# EAGLE schematic plugwatch (EAGLE 9.5.0)
AUTHOR: Joshua Adkins; REV: G; TITLE: PowerWatch

## Sheet 1 of 6: AC input, voltage sensing, AC/DC
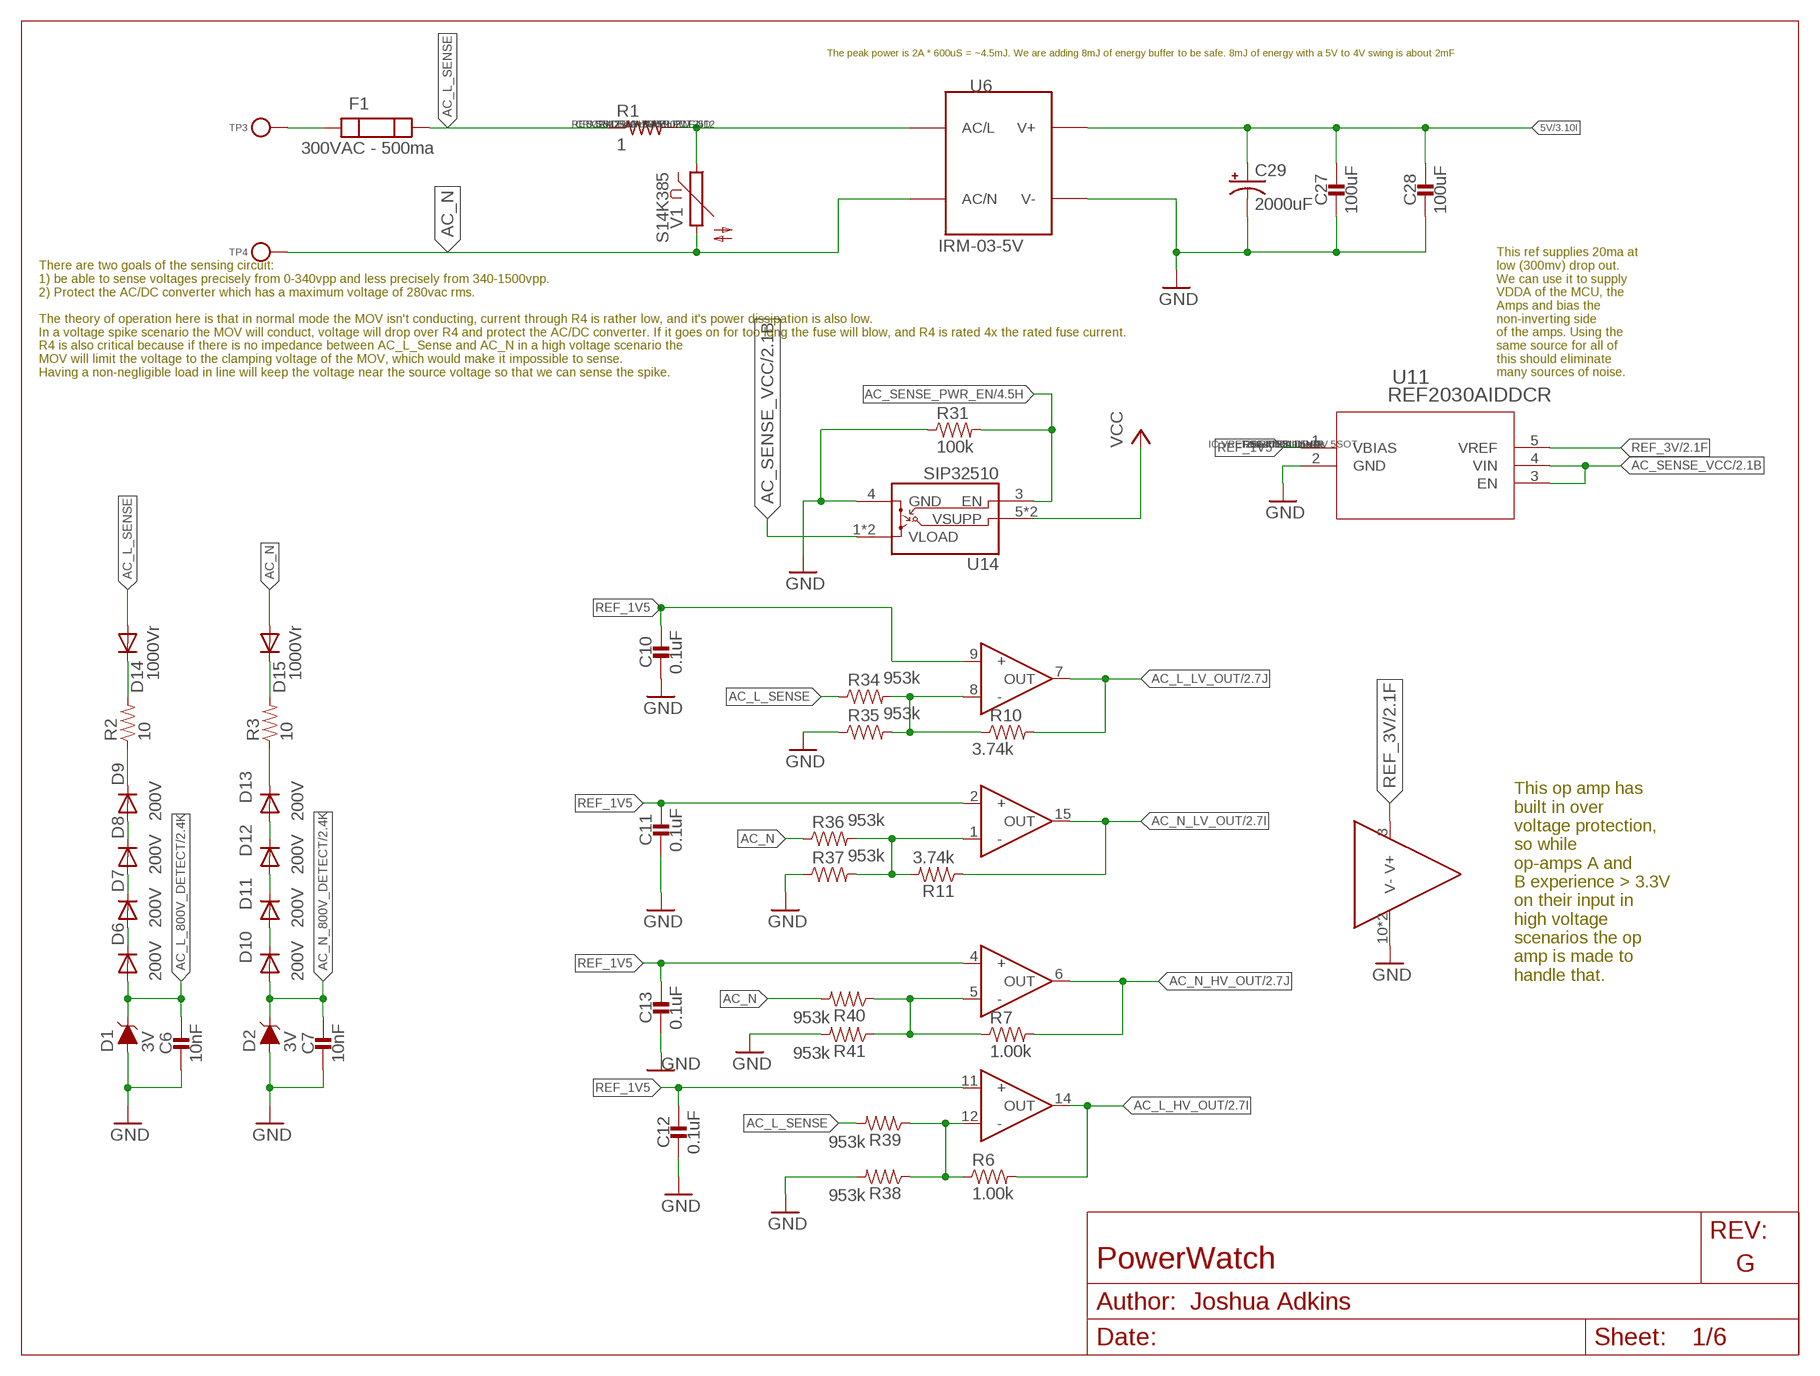
[diagram p0: schematic, sheet 1]

### Parts
C6  10nF  CAPACITOR0402_CAP  [0402_CAP]
C7  10nF  CAPACITOR0402_CAP  [0402_CAP]
C10  0.1uF  CAPACITOR0402_CAP  [0402_CAP]
C11  0.1uF  CAPACITOR0402_CAP  [0402_CAP]
C12  0.1uF  CAPACITOR0402_CAP  [0402_CAP]
C13  0.1uF  CAPACITOR0402_CAP  [0402_CAP]
C27  100uF  CAPACITOR1210_CAP  [1210_CAP]
C28  100uF  CAPACITOR1210_CAP  [1210_CAP]
C29  2000uF  CPOL-USE5-10.5  [E5-10,5]
D1  3V  DIODE-ZENER-MM3Z3V3T1G  [SOD-323]
D2  3V  DIODE-ZENER-MM3Z3V3T1G  [SOD-323]
D6  200V  DIODE-DO214AA  [DO214AA]
D7  200V  DIODE-DO214AA  [DO214AA]
D8  200V  DIODE-DO214AA  [DO214AA]
D9  200V  DIODE-DO214AA  [DO214AA]
D10  200V  DIODE-DO214AA  [DO214AA]
D11  200V  DIODE-DO214AA  [DO214AA]
D12  200V  DIODE-DO214AA  [DO214AA]
D13  200V  DIODE-DO214AA  [DO214AA]
D14  1000Vr  DIODE-DO214AC  [DO214AC]
D15  1000Vr  DIODE-DO214AC  [DO214AC]
F1  300VAC - 500ma  MICRO_FUSE500MA_350VAC  [MIRCRO_FUSE_5MM]
R1  1  R-US_R2512  [R2512]
R2  10  RESISTOR0402_RES  [0402_RES]
R3  10  RESISTOR0402_RES  [0402_RES]
R6  1.00k  RESISTOR0402_RES  [0402_RES]
R7  1.00k  RESISTOR0402_RES  [0402_RES]
R10  3.74k  RESISTOR0402_RES  [0402_RES]
R11  3.74k  RESISTOR0402_RES  [0402_RES]
R31  100k  RESISTOR0402_RES  [0402_RES]
R34  953k  RESISTOR0805_RES  [0805_RES]
R35  953k  RESISTOR0805_RES  [0805_RES]
R36  953k  RESISTOR0805_RES  [0805_RES]
R37  953k  RESISTOR0805_RES  [0805_RES]
R38  953k  RESISTOR0805_RES  [0805_RES]
R39  953k  RESISTOR0805_RES  [0805_RES]
R40  953k  RESISTOR0805_RES  [0805_RES]
R41  953k  RESISTOR0805_RES  [0805_RES]
TP3  TEST_POINT_0.078IN  [TESTPOINT_0.078IN]
TP4  TEST_POINT_0.078IN  [TESTPOINT_0.078IN]
U2  ADA4096-4ACPZ-R7  [CP_16_27]
U6  IRM-03-5V  [IRM-03]
U11  REF2030AIDDCR  REF2033AIDDCR  [DDC5]
U14  SIP32510  [TSOT23-6]
V1  S14K385  [S14K385]

### Nets
5V: C27.1 C28.1 C29.+ U6.V+ ; also sheet 3,4
AC_L_800V_DETECT: C6.1 D1.C D6.A ; also sheet 2,4
AC_L_HV_OUT: R6.2 U2.14(D:OUT) ; also sheet 2,4
AC_L_LV_OUT: R10.2 U2.7(C:OUT) ; also sheet 2,4
AC_L_SENSE: D14.A F1.P$2 R1.1 R34.1 R39.2
AC_N: D15.A R36.1 R40.2 TP4.1(TESTPOINT) U6.AC/N V1.2
AC_N_800V_DETECT: C7.1 D2.C D10.A ; also sheet 2,4
AC_N_HV_OUT: R7.2 U2.6(B:OUT) ; also sheet 2,4
AC_N_LV_OUT: R11.1 U2.15(A:OUT) ; also sheet 2,4
AC_SENSE_PWR_EN: R31.2 U14.3(EN) ; also sheet 4
AC_SENSE_VCC: U11.3(EN) U11.4(VIN) U14.1(VLOAD) U14.2(VLOAD) ; also sheet 2
GND: C6.2 C7.2 C10.2 C11.2 C12.2 C13.2 C27.2 C28.2 C29.- D1.A D2.A R31.1 R35.1 R37.1 R38.2 R41.2 U2.10(SUPPLY:V-) U2.17(SUPPLY:V-) U6.V- U11.2(GND) U14.4(GND) ; also sheet 2,3,4,5,6
N$2: R1.2 U6.AC/L V1.1
N$3: R11.2 R36.2 R37.2 U2.1(A:-)
N$4: R10.1 R34.2 R35.2 U2.8(C:-)
N$6: R6.1 R38.1 R39.1 U2.12(D:-)
N$8: R7.1 R40.1 R41.1 U2.5(B:-)
N$12: F1.P$1 TP3.1(TESTPOINT)
N$14: D8.C D9.A
N$15: D7.C D8.A
N$16: D6.C D7.A
N$30: D9.C R2.1
N$32: D14.C R2.2
N$35: D12.C D13.A
N$37: D11.C D12.A
N$38: D10.C D11.A
N$46: D13.C R3.1
N$47: D15.C R3.2
REF_1V5: C10.1 C11.1 C12.1 C13.1 U2.2(A:+) U2.4(B:+) U2.9(C:+) U2.11(D:+) U11.1(VBIAS)
REF_3V: U2.3(SUPPLY:V+) U11.5(VREF) ; also sheet 2
VCC: U14.5(VSUPP) U14.6(VSUPP) ; also sheet 2,3,4,5,6

### Notes on the sheet
- The peak power is 2A * 600uS = ~4.5mJ. We are adding 8mJ of energy buffer to be safe. 8mJ of energy with a 5V to 4V swing is about 2mF
- There are two goals of the sensing circuit: 
  1) be able to sense voltages precisely from 0-340vpp and less precisely from 340-1500vpp. 
  2) Protect the AC/DC converter which has a maximum voltage of 280vac rms. 
  
  The theory of operation here is that in normal mode the MOV isn't conducting, current through R4 is rather low, and it's power dissipation is also low. 
  In a voltage spike scenario the MOV will conduct, voltage will drop over R4 and protect the AC/DC converter. If it goes on for too long the fuse will blow, and R4 is rated 4x the rated fuse current. 
  R4 is also critical because if there is no impedance between AC_L_Sense and AC_N in a high voltage scenario the 
  MOV will limit the voltage to the clamping voltage of the MOV, which would make it impossible to sense. 
  Having a non-negligible load in line will keep the voltage near the source voltage so that we can sense the spike.
- This ref supplies 20ma at 
  low (300mv) drop out. 
  We can use it to supply 
  VDDA of the MCU, the 
  Amps and bias the 
  non-inverting side 
  of the amps. Using the 
  same source for all of 
  this should eliminate 
  many sources of noise.
- This op amp has 
  built in over 
  voltage protection, 
  so while 
  op-amps A and 
  B experience > 3.3V 
  on their input in 
  high voltage 
  scenarios the op 
  amp is made to 
  handle that.

## Sheet 2 of 6: Voltage Coprocessor
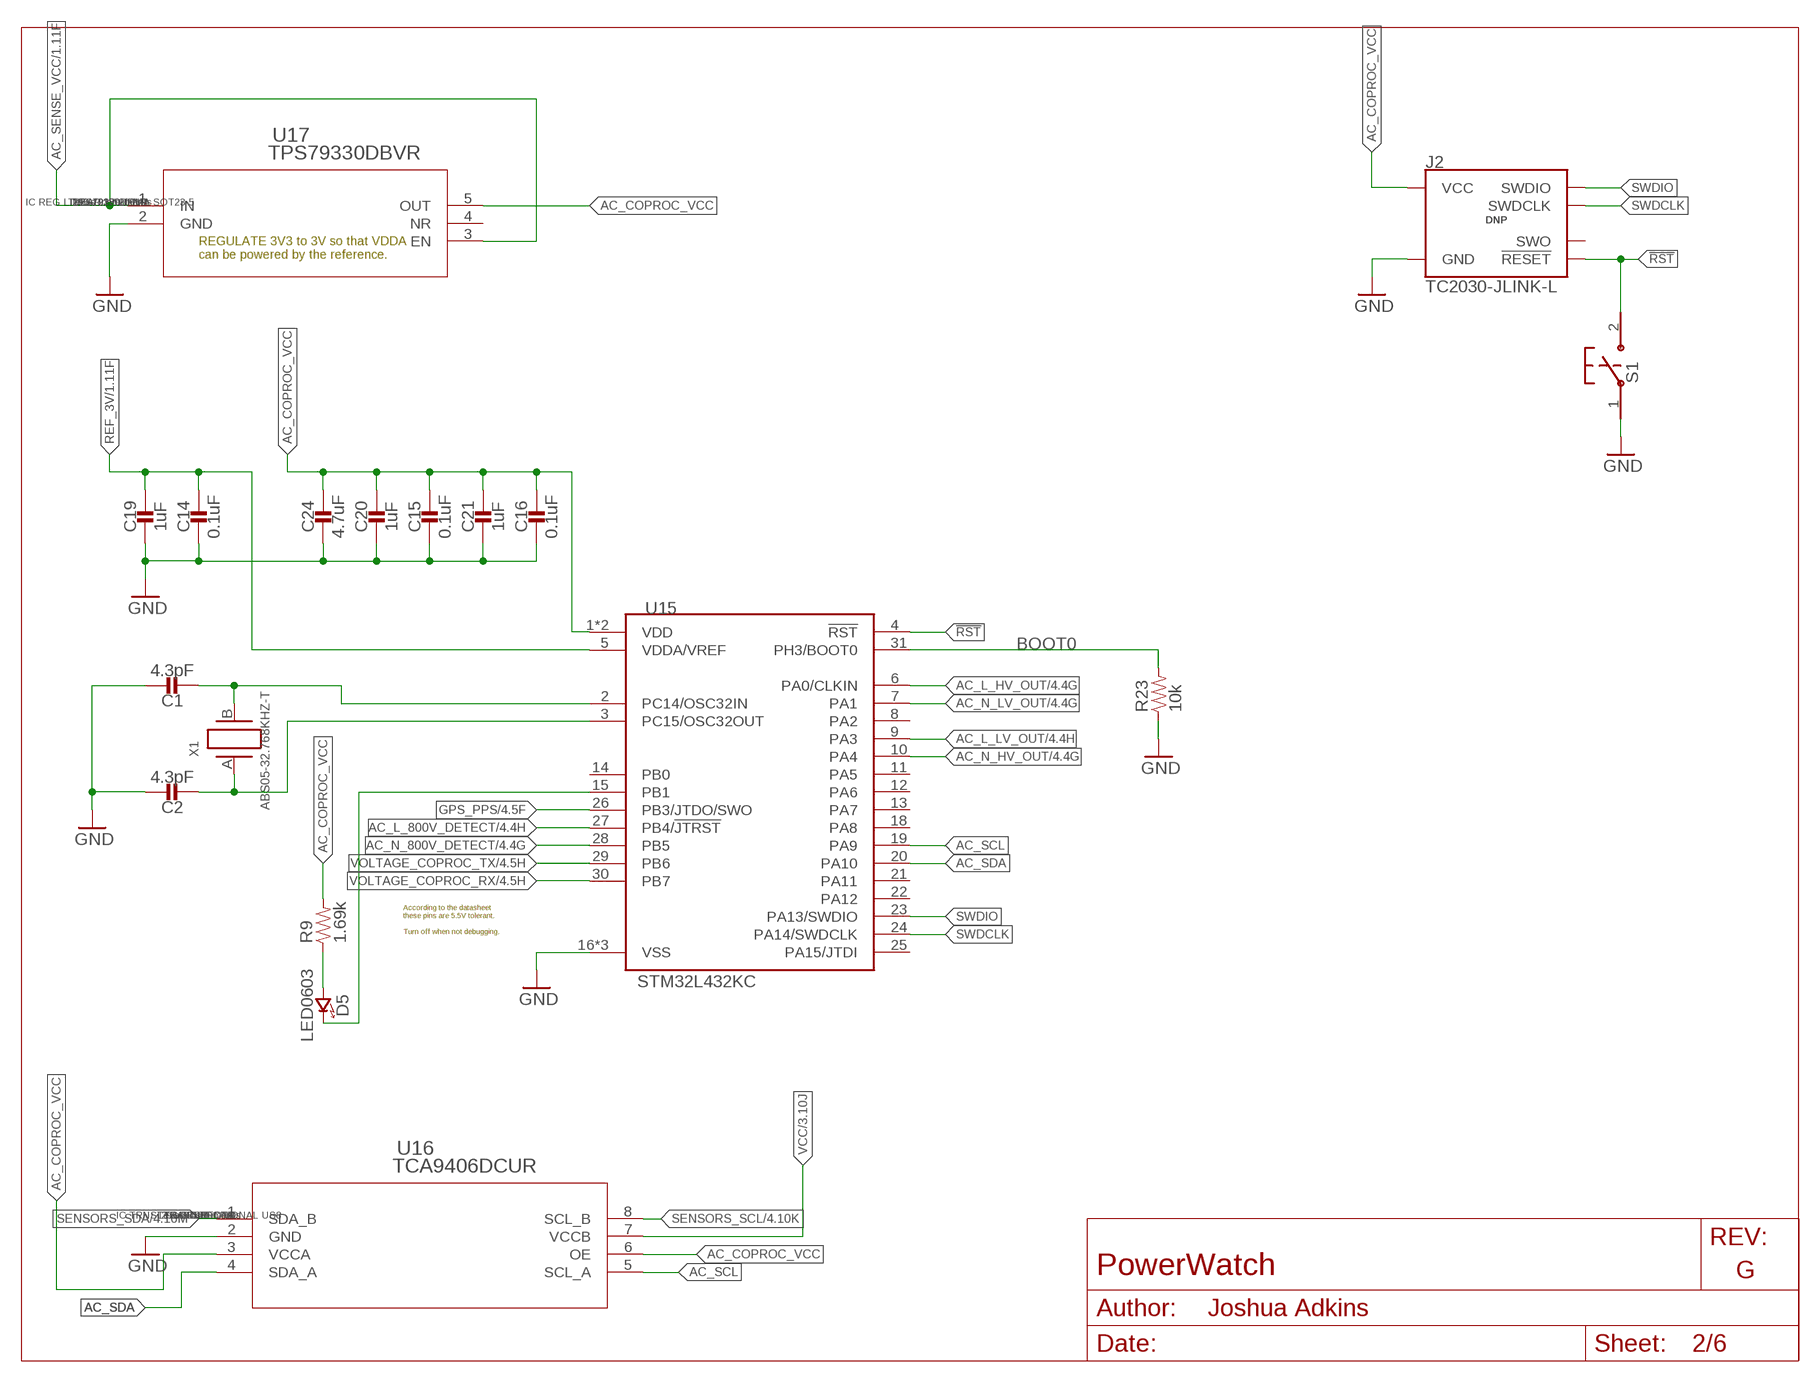
[diagram p1: schematic, sheet 2]

### Parts
C1  4.3pF  CAPACITOR0402_CAP  [0402_CAP]
C2  4.3pF  CAPACITOR0402_CAP  [0402_CAP]
C14  0.1uF  CAPACITOR0402_CAP  [0402_CAP]
C15  0.1uF  CAPACITOR0402_CAP  [0402_CAP]
C16  0.1uF  CAPACITOR0402_CAP  [0402_CAP]
C19  1uF  CAPACITOR0402_CAP  [0402_CAP]
C20  1uF  CAPACITOR0402_CAP  [0402_CAP]
C21  1uF  CAPACITOR0402_CAP  [0402_CAP]
C24  4.7uF  CAPACITOR0402_CAP  [0402_CAP]
D5  LED0603  [LED-0603]
J2  TC2030-JLINK-L  [TC2030-IDC]
R9  1.69k  RESISTOR0402_RES  [0402_RES]
R23  10k  RESISTOR0402_RES  [0402_RES]
S1  B3U-1000P  [B3U-1000P]
U15  STM32L432KC  [UQFN-32]
U16  TCA9406DCUR  [DCU8]
U17  TPS79330DBVR  [DBV5]
X1  ABS05-32.768KHZ-T  [ABS05]

### Nets
!RST: J2.3(!RESET) S1.2 U15.4(!RST)
AC_COPROC_VCC: C15.1 C16.1 C20.1 C21.1 C24.1 J2.1(VCC) R9.2 U15.1(VDD) U15.17(VDD) U16.3(VCCA) U16.6(OE) U17.5(OUT)
AC_L_800V_DETECT: U15.27(PB4/!JTRST) ; also sheet 1,4
AC_L_HV_OUT: U15.6(PA0/CLKIN) ; also sheet 1,4
AC_L_LV_OUT: U15.9(PA3) ; also sheet 1,4
AC_N_800V_DETECT: U15.28(PB5) ; also sheet 1,4
AC_N_HV_OUT: U15.10(PA4) ; also sheet 1,4
AC_N_LV_OUT: U15.7(PA1) ; also sheet 1,4
AC_SCL: U15.19(PA9) U16.5(SCL_A)
AC_SDA: U15.20(PA10) U16.4(SDA_A)
AC_SENSE_VCC: U17.1(IN) U17.3(EN) ; also sheet 1
BOOT0: R23.2 U15.31(PH3/BOOT0)
GND: C1.1 C2.1 C14.2 C15.2 C16.2 C19.2 C20.2 C21.2 C24.2 J2.5(GND) R23.1 S1.1 U15.16(VSS) U15.32(VSS) U15.THERMAL(VSS) U16.2(GND) U17.2(GND) ; also sheet 1,3,4,5,6
GPS_PPS: U15.26(PB3/JTDO/SWO) ; also sheet 4,5
N$1: D5.A(ANODE) R9.1
N$7: D5.C(CATHODE) U15.15(PB1)
N$9: C2.2 U15.3(PC15/OSC32OUT) X1.A
N$11: C1.2 U15.2(PC14/OSC32IN) X1.B
REF_3V: C14.1 C19.1 U15.5(VDDA/VREF) ; also sheet 1
SENSORS_SCL: U16.8(SCL_B) ; also sheet 4,6
SENSORS_SDA: U16.1(SDA_B) ; also sheet 4,6
SWDCLK: J2.4(SWDCLK) U15.24(PA14/SWDCLK)
SWDIO: J2.2(SWDIO) U15.23(PA13/SWDIO)
VCC: U16.7(VCCB) ; also sheet 1,3,4,5,6
VOLTAGE_COPROC_RX: U15.30(PB7) ; also sheet 4
VOLTAGE_COPROC_TX: U15.29(PB6) ; also sheet 4
Unconnected: J2.6(SWO) U15.8(PA2) U15.11(PA5) U15.12(PA6) U15.13(PA7) U15.14(PB0) U15.18(PA8) U15.21(PA11) U15.22(PA12) U15.25(PA15/JTDI) U17.4(NR)

### Notes on the sheet
- REGULATE 3V3 to 3V so that VDDA
  can be powered by the reference.
- According to the datasheet
  these pins are 5.5V tolerant.
  
  Turn off when not debugging.

## Sheet 3 of 6: Supervisor, Watchdog, RTC
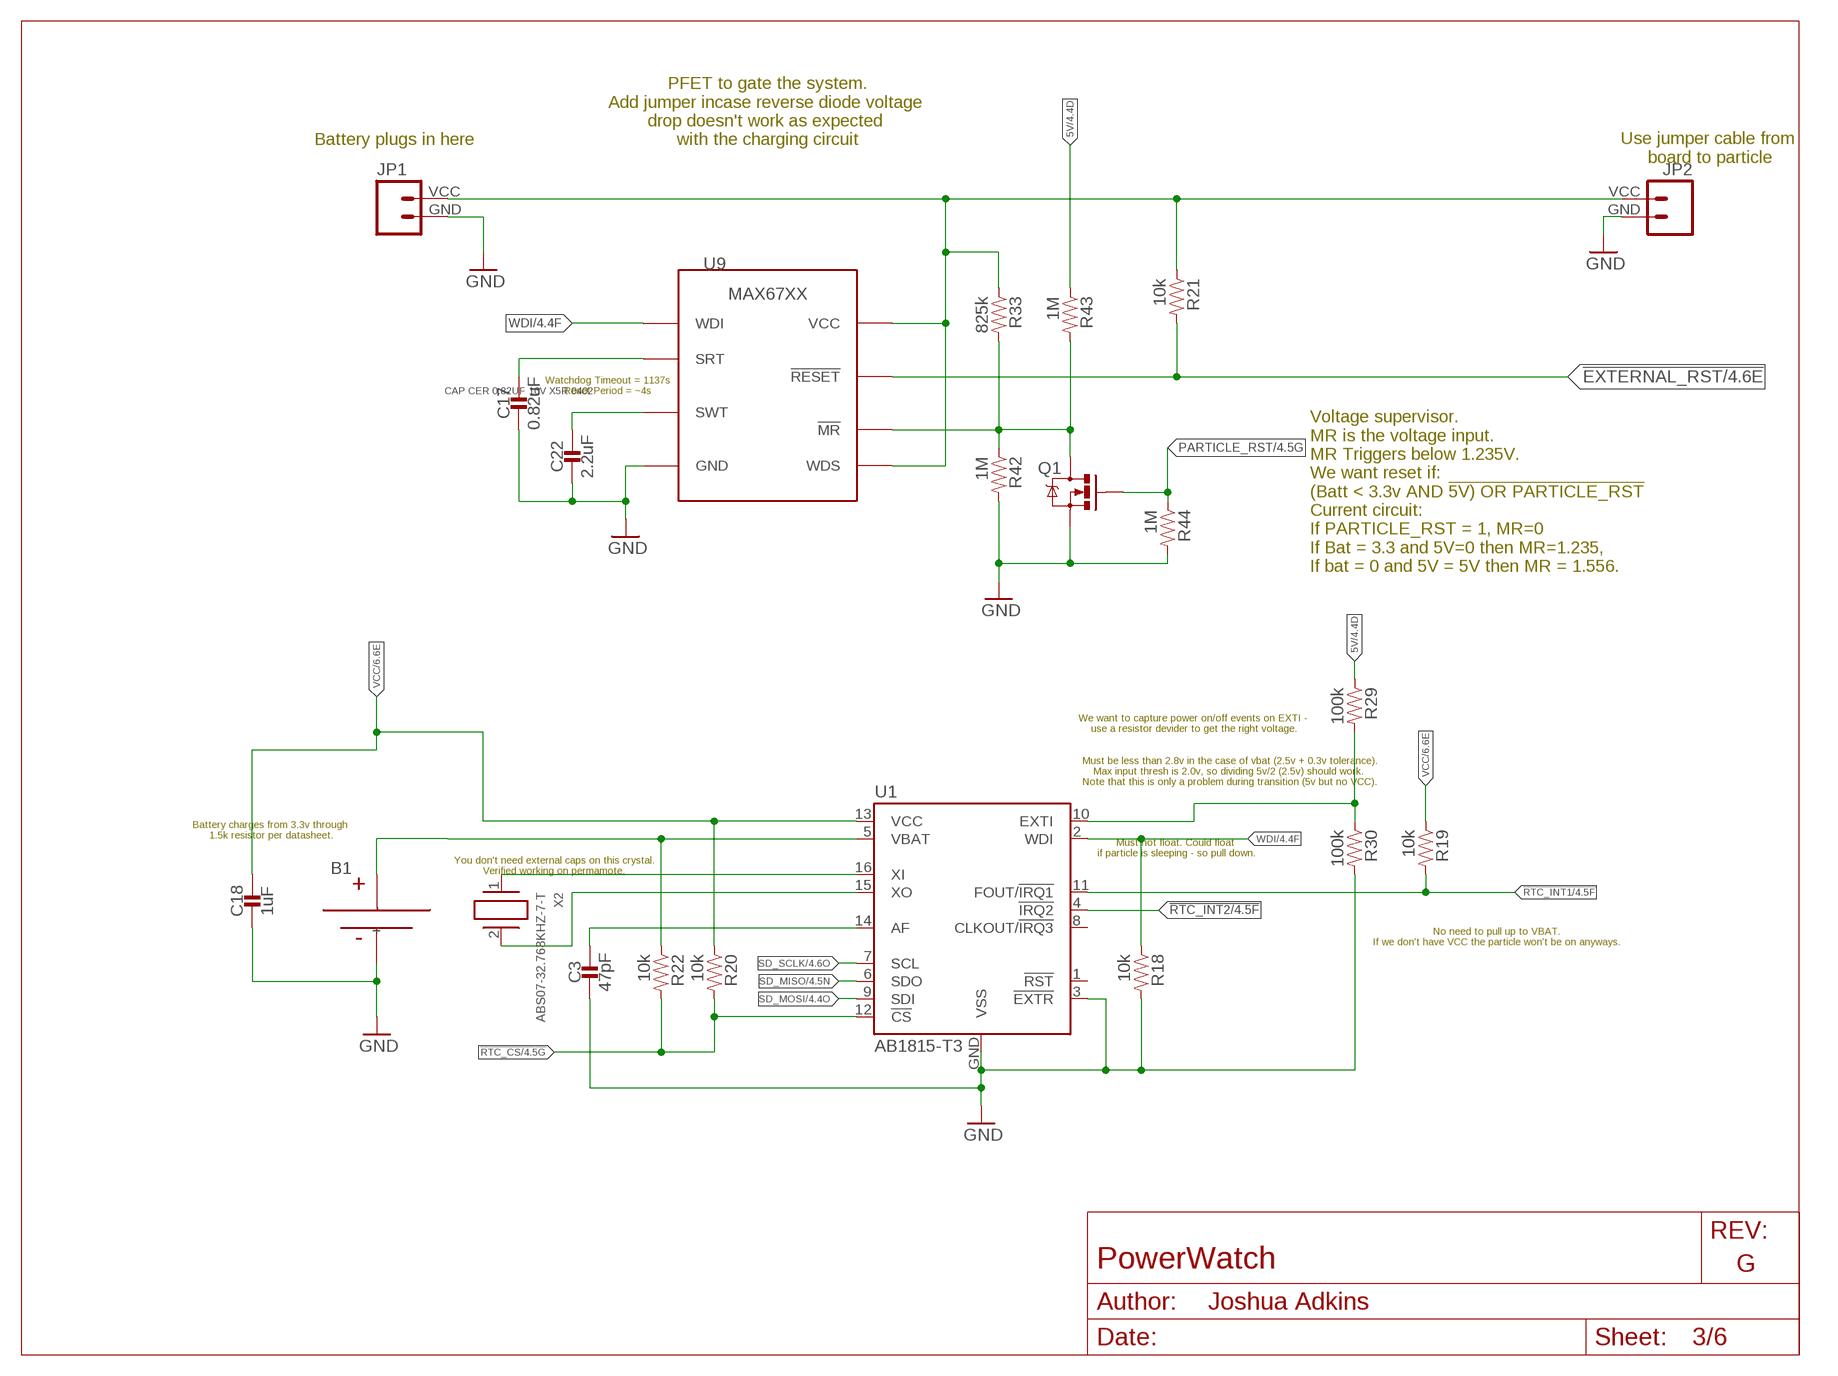
[diagram p2: schematic, sheet 3]

### Parts
B1  MS518SE  [MS518SE-FL35E]
C3  47pF  CAPACITOR0402_CAP  [0402_CAP]
C17  0.82uF  CAPACITOR0402_CAP  [0402_CAP]
C18  1uF  CAPACITOR0402_CAP  [0402_CAP]
C22  2.2uF  CAPACITOR0402_CAP  [0402_CAP]
JP1  M024UCON-15767  [JST-2-SMD-VERT]
JP2  M024UCON-15767  [JST-2-SMD-VERT]
Q1  MOSFET-NCHANNELSMD  [SOT23-3]
R18  10k  RESISTOR0402_RES  [0402_RES]
R19  10k  RESISTOR0402_RES  [0402_RES]
R20  10k  RESISTOR0402_RES  [0402_RES]
R21  10k  RESISTOR0402_RES  [0402_RES]
R22  10k  RESISTOR0402_RES  [0402_RES]
R29  100k  RESISTOR0402_RES  [0402_RES]
R30  100k  RESISTOR0402_RES  [0402_RES]
R33  825k  RESISTOR0402_RES  [0402_RES]
R42  1M  RESISTOR0402_RES  [0402_RES]
R43  1M  RESISTOR0402_RES  [0402_RES]
R44  1M  RESISTOR0402_RES  [0402_RES]
U1  AB1815-T3  [QFN-16-3MM]
U9  MAX67XXMAX6749MAX67XX  [SOT-23-8]
X2  ABS07-32.768KHZ-7-T  [2-SMD]

### Nets
5V: R29.1 R43.1 ; also sheet 1,4
!EXTERNAL_RST: R21.2 U9.7(!RESET) ; also sheet 4
!RTC_CS: R20.2 R22.2 U1.12(!CS) ; also sheet 4
!RTC_INT1: R19.2 U1.11(FOUT/!IRQ1) ; also sheet 4
!RTC_INT2: U1.4(!IRQ2) ; also sheet 4
GND: B1.- C3.2 C17.2 C18.2 C22.2 JP1.GND JP2.GND Q1.2(S) R18.2 R30.2 R42.2 R44.2 U1.3(!EXTR) U1.GND(VSS) U9.4(GND) ; also sheet 1,2,4,5,6
N$5: B1.+ R22.1 U1.5(VBAT)
N$13: C3.1 U1.14(AF)
N$20: U1.15(XO) X2.2
N$21: U1.16(XI) X2.1
N$23: JP1.VCC JP2.VCC R21.1 R33.1 U9.5(WDS) U9.8(VCC)
N$25: R29.2 R30.1 U1.10(EXTI)
N$31: Q1.3(D) R33.2 R42.1 R43.2 U9.1(!MR)
N$36: C17.1 U9.3(SRT)
N$39: C22.1 U9.2(SWT)
PARTICLE_RST: Q1.1(G) R44.1 ; also sheet 4
SD_MISO: U1.6(SDO) ; also sheet 4
SD_MOSI: U1.9(SDI) ; also sheet 4
SD_SCLK: U1.7(SCL) ; also sheet 4
VCC: C18.1 R19.1 R20.1 U1.13(VCC) ; also sheet 1,2,4,5,6
WDI: R18.1 U1.2(WDI) U9.6(WDI) ; also sheet 4
Unconnected: U1.1(!RST) U1.8(CLKOUT/!IRQ3)

### Notes on the sheet
- Battery plugs in here
- PFET to gate the system.
  Add jumper incase reverse diode voltage 
  drop doesn't work as expected 
  with the charging circuit
- Use jumper cable from 
  board to particle
- Watchdog Timeout = 1137s
  Reset Period = ~4s
- Voltage supervisor.
  MR is the voltage input.
  MR Triggers below 1.235V.
  We want reset if:
  (Batt < 3.3v AND !5V) OR PARTICLE_RST
  Current circuit:
  If PARTICLE_RST = 1, MR=0
  If Bat = 3.3 and 5V=0 then MR=1.235, 
  If bat = 0 and 5V = 5V then MR = 1.556.
- We want to capture power on/off events on EXTI - 
  use a resistor devider to get the right voltage.
- Must be less than 2.8v in the case of vbat (2.5v + 0.3v tolerance).
  Max input thresh is 2.0v, so dividing 5v/2 (2.5v) should work. 
  Note that this is only a problem during transition (5v but no VCC).
- Battery charges from 3.3v through
   1.5k resistor per datasheet.
- Must not float. Could float 
  if particle is sleeping - so pull down.
- You don't need external caps on this crystal.
  Verified working on permamote.
- No need to pull up to VBAT.
  If we don't have VCC the particle won't be on anyways.

## Sheet 4 of 6: Particle and SD Card
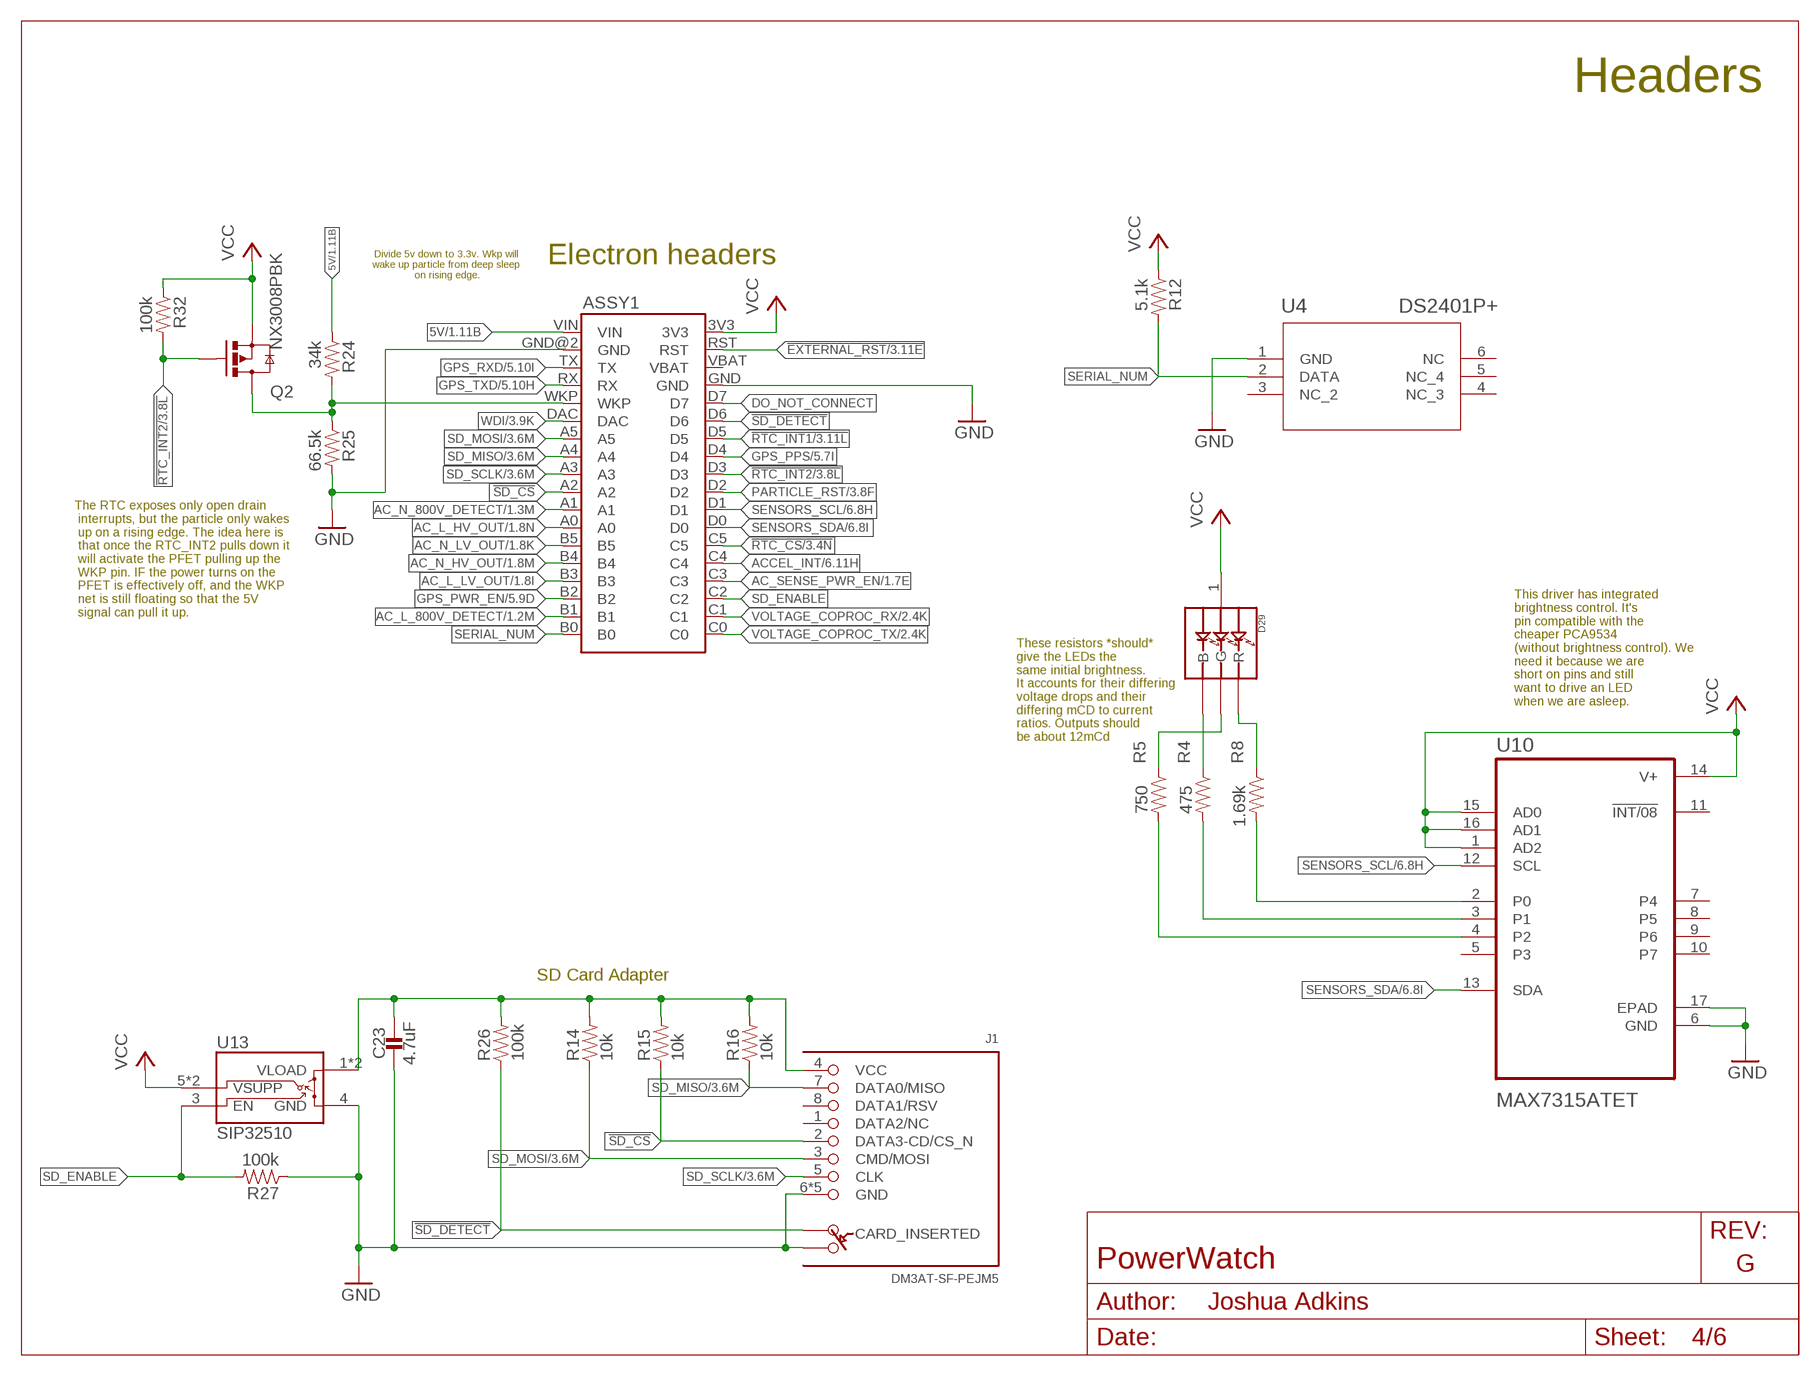
[diagram p3: schematic, sheet 4]

### Parts
ASSY1  ELECTRON  [ELECTRON_SINGLE-ROW]
C23  4.7uF  CAPACITOR0402_CAP  [0402_CAP]
D29  SML-LX0404SIUPGUSB  [1MM_SQ_4PAD]
J1  DM3AT-SF-PEJM5  [DM3AT-SF-PEJM5]
Q2  NX3008PBK  [SOT23-3]
R4  475  RESISTOR0402_RES  [0402_RES]
R5  750  RESISTOR0402_RES  [0402_RES]
R8  1.69k  RESISTOR0402_RES  [0402_RES]
R12  5.1k  RESISTOR0402_RES  [0402_RES]
R14  10k  RESISTOR0402_RES  [0402_RES]
R15  10k  RESISTOR0402_RES  [0402_RES]
R16  10k  RESISTOR0402_RES  [0402_RES]
R24  34k  RESISTOR0402_RES  [0402_RES]
R25  66.5k  RESISTOR0402_RES  [0402_RES]
R26  100k  RESISTOR0402_RES  [0402_RES]
R27  100k  RESISTOR0402_RES  [0402_RES]
R32  100k  RESISTOR0402_RES  [0402_RES]
U4  DS2401P+  [21-0382]
U10  MAX7315ATET  [QFN50P300X300X80-17N]
U13  SIP32510  [TSOT23-6]

### Nets
5V: ASSY1.VIN R24.1 ; also sheet 1,3
!EXTERNAL_RST: ASSY1.RST ; also sheet 3
!RTC_CS: ASSY1.C5 ; also sheet 3
!RTC_INT1: ASSY1.D5 ; also sheet 3
!RTC_INT2: ASSY1.D3 Q2.1(G) R32.2 ; also sheet 3
!SD_CS: ASSY1.A2 J1.2(DATA3-CD/CS_N) R15.1
!SD_DETECT: ASSY1.D6 J1.A R26.1
AC_L_800V_DETECT: ASSY1.B1 ; also sheet 1,2
AC_L_HV_OUT: ASSY1.A0 ; also sheet 1,2
AC_L_LV_OUT: ASSY1.B3 ; also sheet 1,2
AC_N_800V_DETECT: ASSY1.A1 ; also sheet 1,2
AC_N_HV_OUT: ASSY1.B4 ; also sheet 1,2
AC_N_LV_OUT: ASSY1.B5 ; also sheet 1,2
AC_SENSE_PWR_EN: ASSY1.C3 ; also sheet 1
ACCEL_INT: ASSY1.C4 ; also sheet 6
DO_NOT_CONNECT: ASSY1.D7
GND: ASSY1.GND ASSY1.GND@2(GND) C23.2 J1.6(GND) J1.B J1.MOUNT0(GND) J1.MOUNT1(GND) J1.MOUNT2(GND) J1.MOUNT3(GND) R25.2 R27.1 U4.1(GND) U10.6(GND) U10.17(EPAD) U13.4(GND) ; also sheet 1,2,3,5,6
GPS_PPS: ASSY1.D4 ; also sheet 2,5
GPS_PWR_EN: ASSY1.B2 ; also sheet 5
GPS_RXD: ASSY1.TX ; also sheet 5
GPS_TXD: ASSY1.RX ; also sheet 5
N$10: ASSY1.WKP Q2.3(D) R24.2 R25.1
N$18: C23.1 J1.4(VCC) R14.2 R15.2 R16.2 R26.2 U13.1(VLOAD) U13.2(VLOAD)
N$26: D29.3(B) R4.1
N$42: D29.4(G) R5.1
N$49: D29.2(R) R8.1
N$50: R8.2 U10.2(P0)
N$51: R5.2 U10.4(P2)
N$52: R4.2 U10.3(P1)
PARTICLE_RST: ASSY1.D2 ; also sheet 3
SD_ENABLE: ASSY1.C2 R27.2 U13.3(EN)
SD_MISO: ASSY1.A4 J1.7(DATA0/MISO) R16.1 ; also sheet 3
SD_MOSI: ASSY1.A5 J1.3(CMD/MOSI) R14.1 ; also sheet 3
SD_SCLK: ASSY1.A3 J1.5(CLK) ; also sheet 3
SENSORS_SCL: ASSY1.D1 U10.12(SCL) ; also sheet 2,6
SENSORS_SDA: ASSY1.D0 U10.13(SDA) ; also sheet 2,6
SERIAL_NUM: ASSY1.B0 R12.2 U4.2(DATA)
VCC: ASSY1.3V3 D29.1(VDD) Q2.2(S) R12.1 R32.1 U10.1(AD2) U10.14(V+) U10.15(AD0) U10.16(AD1) U13.5(VSUPP) U13.6(VSUPP) ; also sheet 1,2,3,5,6
VOLTAGE_COPROC_RX: ASSY1.C1 ; also sheet 2
VOLTAGE_COPROC_TX: ASSY1.C0 ; also sheet 2
WDI: ASSY1.DAC ; also sheet 3
Unconnected: ASSY1.VBAT J1.1(DATA2/NC) J1.8(DATA1/RSV) U4.3(NC_2) U4.4(NC_3) U4.5(NC_4) U4.6(NC) U10.5(P3) U10.7(P4) U10.8(P5) U10.9(P6) U10.10(P7) U10.11(!INT/08)

### Notes on the sheet
- Headers
- Electron headers
- Divide 5v down to 3.3v. Wkp will 
  wake up particle from deep sleep 
  on rising edge.
- The RTC exposes only open drain
   interrupts, but the particle only wakes
   up on a rising edge. The idea here is
   that once the RTC_INT2 pulls down it
   will activate the PFET pulling up the
   WKP pin. IF the power turns on the
   PFET is effectively off, and the WKP
   net is still floating so that the 5V
   signal can pull it up.
- This driver has integrated 
  brightness control. It's 
  pin compatible with the 
  cheaper PCA9534 
  (without brightness control). We 
  need it because we are 
  short on pins and still 
  want to drive an LED 
  when we are asleep.
- These resistors *should* 
  give the LEDs the 
  same initial brightness. 
  It accounts for their differing
  voltage drops and their
  differing mCD to current
  ratios. Outputs should 
  be about 12mCd
- SD Card Adapter

## Sheet 5 of 6: GPS Radio
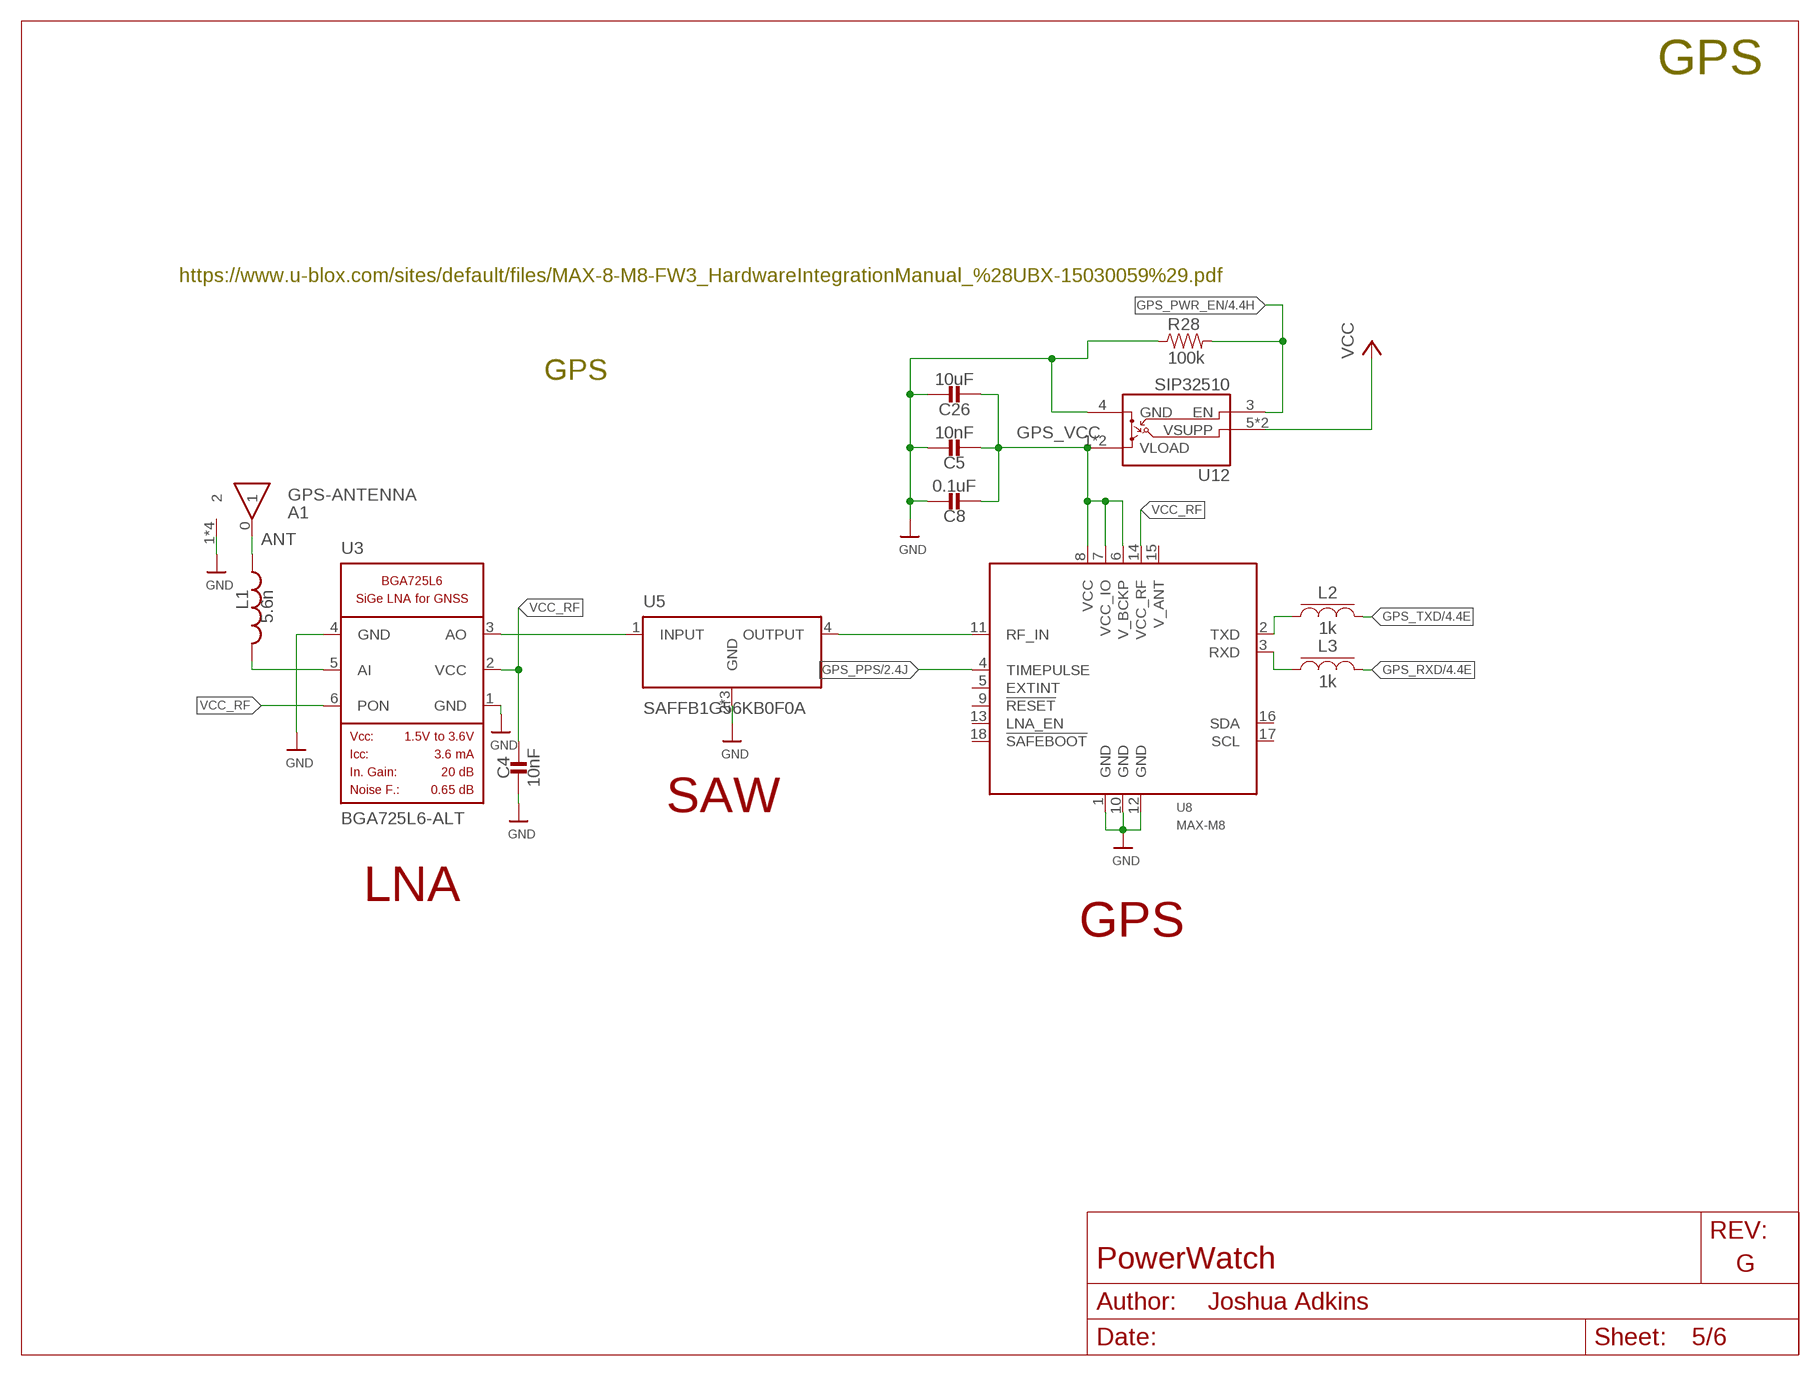
[diagram p4: schematic, sheet 5]

### Parts
A1  GPS-ANTENNA  [ANT1818B00BT1516S]
C4  10nF  CAPACITOR0402_CAP  [0402_CAP]
C5  10nF  CAPACITOR0402_CAP  [0402_CAP]
C8  0.1uF  CAPACITOR0402_CAP  [0402_CAP]
C26  10uF  CAPACITOR0402_CAP  [0402_CAP]
L1  5.6n  INDUCTOR0402  [0402_CAP]
L2  1k  FERRITE_BEAD0402  [0402_CAP]
L3  1k  FERRITE_BEAD0402  [0402_CAP]
R28  100k  RESISTOR0402_RES  [0402_RES]
U3  BGA725L6-ALT  [LNA-TSLP-6-2-ALT]
U5  SAFFB1G56KB0F0A  FILTERS  [QCS5I]
U8  MAX-M8  [MAX-M8]
U12  SIP32510  [TSOT23-6]

### Nets
ANT: A1.0 L1.2
GND: A1.1 A1.2 A1.3 A1.4 C4.1 C5.1 C8.1 C26.1 R28.1 U3.1(GND) U3.4(GND) U5.2(GND) U5.3(GND) U5.5(GND) U8.1(GND) U8.10(GND) U8.12(GND) U12.4(GND) ; also sheet 1,2,3,4,6
GPS_PPS: U8.4(TIMEPULSE) ; also sheet 2,4
GPS_PWR_EN: R28.2 U12.3(EN) ; also sheet 4
GPS_RF_IN: U5.4(OUTPUT) U8.11(RF_IN)
GPS_RXD: L3.2 ; also sheet 4
GPS_TXD: L2.2 ; also sheet 4
GPS_VCC: C5.2 C8.2 C26.2 U8.6(V_BCKP) U8.7(VCC_IO) U8.8(VCC) U12.1(VLOAD) U12.2(VLOAD)
LNA_IN: L1.1 U3.5(AI)
LNA_OUT: U3.3(AO) U5.1(INPUT)
N$40: L2.1 U8.2(TXD)
N$41: L3.1 U8.3(RXD)
VCC: U12.5(VSUPP) U12.6(VSUPP) ; also sheet 1,2,3,4,6
VCC_RF: C4.2 U3.2(VCC) U3.6(PON) U8.14(VCC_RF)
Unconnected: U8.5(EXTINT) U8.9(!RESET) U8.13(LNA_EN) U8.15(V_ANT) U8.16(SDA) U8.17(SCL) U8.18(!SAFEBOOT)

### Notes on the sheet
- GPS
- https://www.u-blox.com/sites/default/files/MAX-8-M8-FW3_HardwareIntegrationManual_%28UBX-15030059%29.pdf
- GPS
- SAW
- LNA
- GPS

## Sheet 6 of 6: Sensors
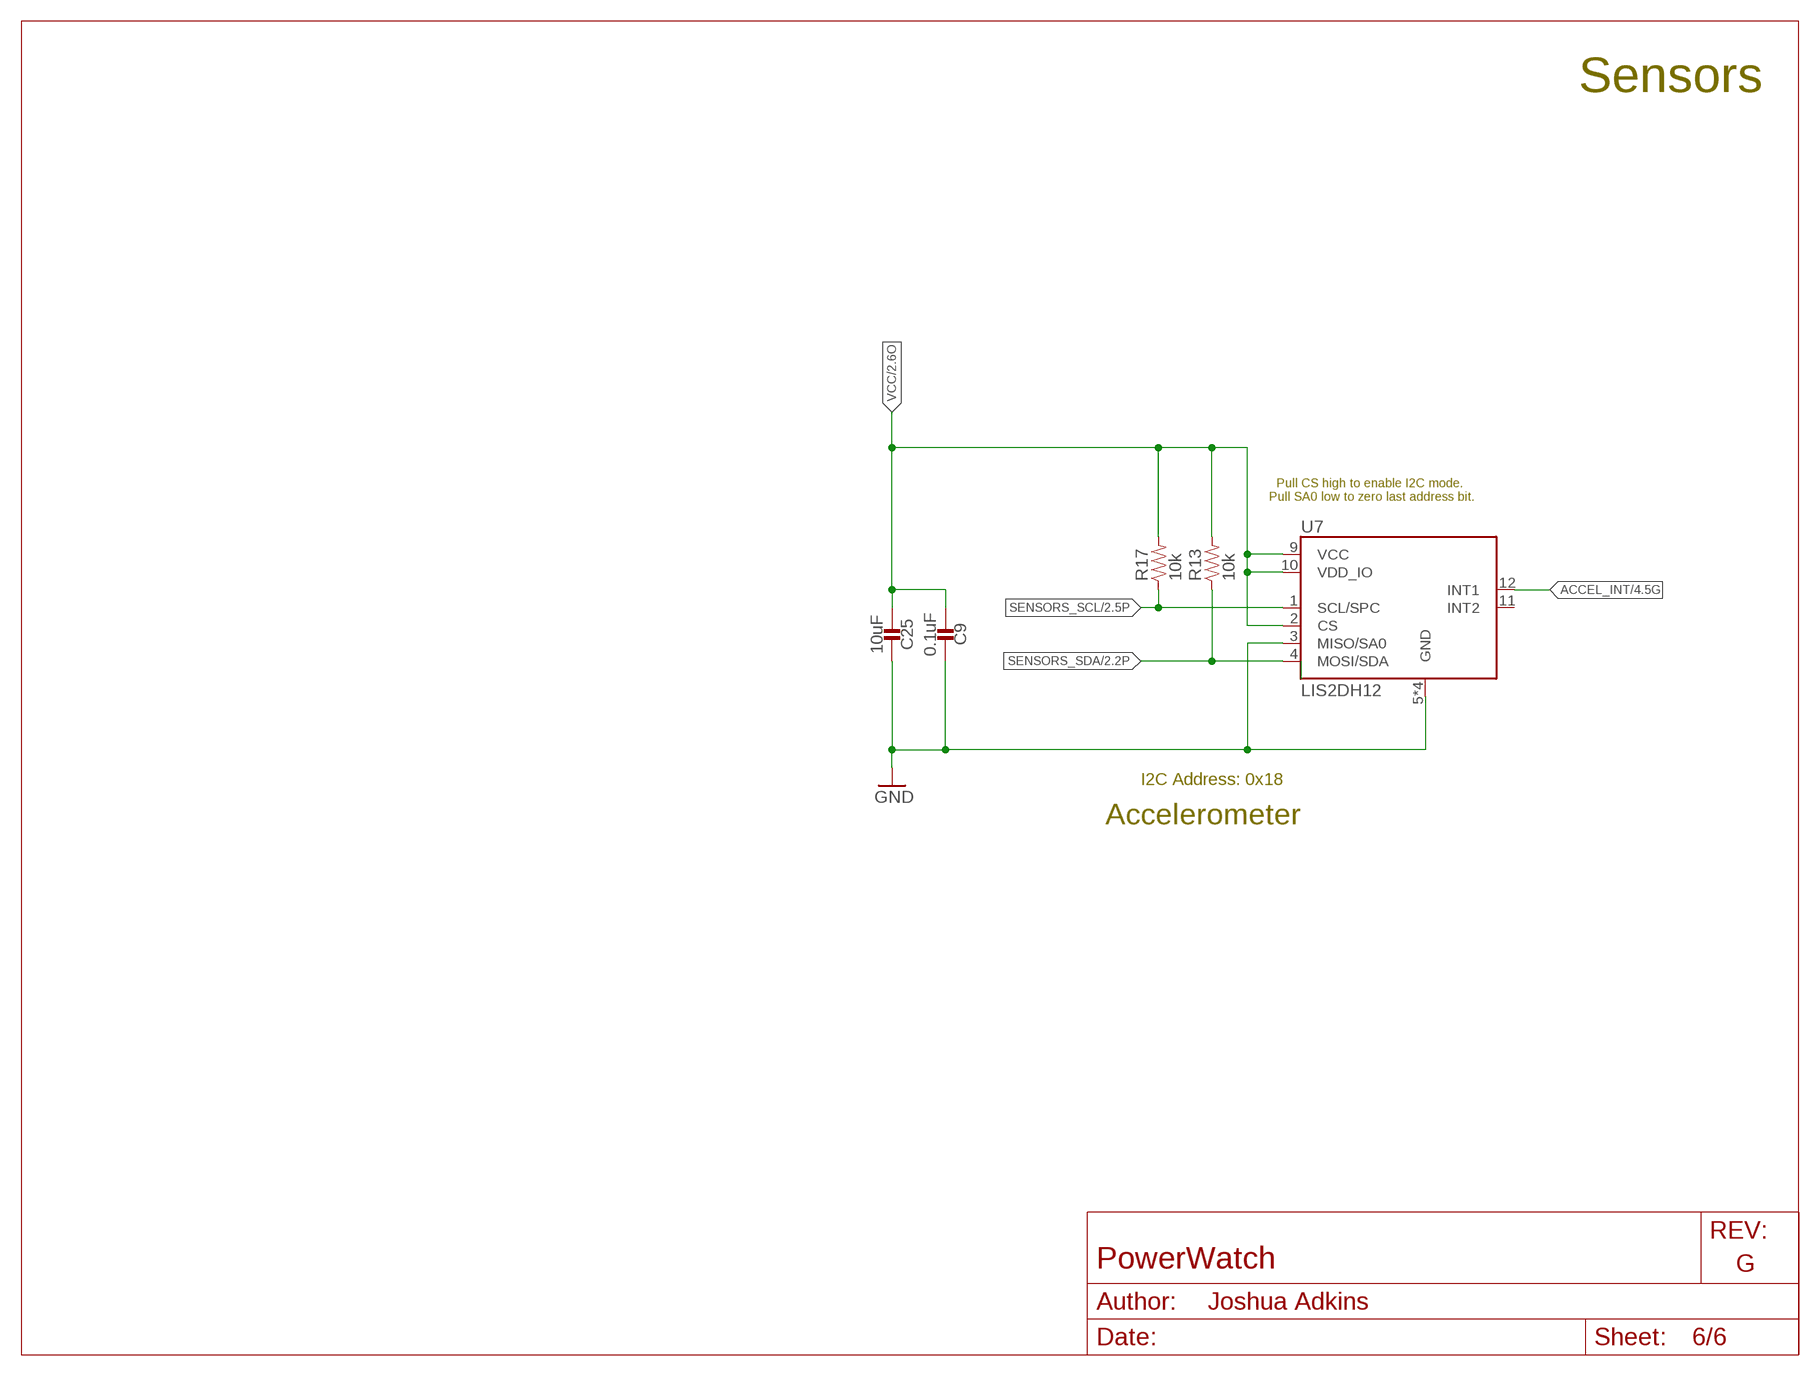
[diagram p5: schematic, sheet 6]

### Parts
C9  0.1uF  CAPACITOR0402_CAP  [0402_CAP]
C25  10uF  CAPACITOR0402_CAP  [0402_CAP]
R13  10k  RESISTOR0402_RES  [0402_RES]
R17  10k  RESISTOR0402_RES  [0402_RES]
U7  LIS2DH12  LIS2DW12  [LGA-12]

### Nets
ACCEL_INT: U7.12(INT1) ; also sheet 4
GND: C9.2 C25.2 U7.3(MISO/SA0) U7.5(GND) U7.6(GND) U7.7(GND) U7.8(GND) ; also sheet 1,2,3,4,5
SENSORS_SCL: R17.1 U7.1(SCL/SPC) ; also sheet 2,4
SENSORS_SDA: R13.1 U7.4(MOSI/SDA) ; also sheet 2,4
VCC: C9.1 C25.1 R13.2 R17.2 U7.2(CS) U7.9(VCC) U7.10(VDD_IO) ; also sheet 1,2,3,4,5
Unconnected: U7.11(INT2)

### Notes on the sheet
- Sensors
- Pull CS high to enable I2C mode. 
  Pull SA0 low to zero last address bit.
- I2C Address: 0x18
- Accelerometer

## Library data of the parts
A1 = antenna:GPS-ANTENNA; DESCRIPTION: PATCH ANT GPS/GLO CP SMD; DIGIKEY: 311-1531-ND; MANUFACTURER: Yageo; MPN: ANT1818B00BT1516S
ASSY1 = electron:ELECTRON; DESCRIPTION: 18 Position header; DIGIKEY: S7051-ND,S7051-ND; MANUFACTURER: Sullins; MPN: PPPC181LFBN-RC
B1 = batteries:MS518SE: A small, low leakage rechargeable battery for RTC backup; DIGIKEY: 728-1054-ND; MANUFACTURER: Seiko; MPN: MS518SE-FL35E
C1 C2 = passives:CAPACITOR: SMD Capacitor; DESCRIPTION: CAP CER 4.3PF 50V C0G/NP0 0402; DIGIKEY: 490-3099-1-ND; MANUFACTURER: Murata Electronics North America; MPN: GJM1555C1H4R3CB01D
C3 = passives:CAPACITOR: SMD Capacitor; DESCRIPTION: CAP CER 47PF 100V C0G/NP0 0402; DIGIKEY: 490-7307-1-ND; MANUFACTURER: Murata Electronics North America; MPN: GRM1555C2A470JA01D
C4-C7 = passives:CAPACITOR: SMD Capacitor; DESCRIPTION: CAP CER 10000PF 16V X7R 0402; DIGIKEY: 490-1313-1-ND; MANUFACTURER: Murata Electronics North America; MPN: GRM155R71C103KA01D
C8-C16 = passives:CAPACITOR: SMD Capacitor; DESCRIPTION: CAP CER 0.1UF 10V X5R 0402; DIGIKEY: 311-1336-1-ND; MANUFACTURER: Yageo; MPN: CC0402KRX5R6BB104
C17 = passives:CAPACITOR: SMD Capacitor; DESCRIPTION: CAP CER 0.82UF 10V X5R 0402; DIGIKEY: 311-3789-1-ND; MANUFACTURER: Yageo; MPN: CC0402KRX5R6BB824
C18-C21 = passives:CAPACITOR: SMD Capacitor; DESCRIPTION: CAP CER 1UF 10V X7S 0402; DIGIKEY: 490-13409-1-ND; MANUFACTURER: Murata Electronics North America; MPN: GCM155C71A105KE38D
C22 = passives:CAPACITOR: SMD Capacitor; DIGIKEY: 490-12696-1-ND; MANUFACTURER: Murata Electronics North America; MPN: GRM155C70J225KE11D
C23 C24 = passives:CAPACITOR: SMD Capacitor; DESCRIPTION: CAP CER 4.7UF 6.3V X5R 0402; DIGIKEY: 445-5947-1-ND; MANUFACTURER: TDK Corporation; MPN: C1005X5R0J475K050BC
C25 C26 = passives:CAPACITOR: SMD Capacitor; DESCRIPTION: CAP CER 10UF 6.3V X5R 0402; DIGIKEY: 490-13211-1-ND; MANUFACTURER: Murata Electronics North America; MPN: GRJ155R60J106ME11D
C27 C28 = passives:CAPACITOR: SMD Capacitor; DESCRIPTION: CAP CER 100UF 6.3V X7S 1210; DIGIKEY: 490-10530-1-ND; MANUFACTURER: Murata Electronics North America; MPN: GRM32EC70J107ME15L
C29 = rcl:CPOL-US: POLARIZED CAPACITOR, American symbol; DESCRIPTION: CAP ALUM 2000UF 20% 6.3V T/H; DIGIKEY: P122284TB-ND; MANUFACTURER: Panasonic Electronic Components; MPN: EEU-FS0J202B; SPICEPREFIX: C
D1 D2 = SparkFun-DiscreteSemi:DIODE-ZENER: Zener Diode A Zener diode allows current to flow from its anode to its cathode like a normal semiconductor diode, but it also permits current to flow in the reverse direction when its "Zener voltage" is reached. - WIkipedia; DESCRIPTION: DIODE ZENER 3V 300MW SOD323; DIGIKEY: MM3Z3V0ST1GOSCT-ND; MANUFACTURER: ON Semiconductor; MPN: MM3Z3V0ST1G; PROD_ID: DIO-11284; VALUE: 3.3V
D5 = leds:LED: LED; DESCRIPTION: LED RED DIFFUSED 1608 SMD; DIGIKEY: SML-D12U1WT86CT-ND; MANUFACTURER: Rohm Semiconductor; MPN: SML-D12U1WT86
D6-D13 = diode:DIODE-: DIODE; DESCRIPTION: DIODE ZENER 200V 3W DO214AA; DIGIKEY: 1PGSMB5956R5GCT-ND; MANUFACTURER: Taiwan Semiconductor Corporation; MPN: 1PGSMB5956 R5G
D14 D15 = diode:DIODE-: DIODE; DESCRIPTION: DIODE GEN PURP 1KV 1A SMA; DIGIKEY: S1M-FDICT-ND; MANUFACTURER: Diodes Incorporated; MPN: S1M-13-F
D29 = leds:SML-LX0404SIUPGUSB: 1mm^2 RGB LED; DIGIKEY: 67-2125-1-ND; MANUFACTURER: Lumex Opto; MPN: SML-LX0404SIUPGUSB
F1 = powerwatch:MICRO_FUSE: A 5mm AC micro fuse package; DESCRIPTION: FUSE BRD MNT 500MA 350VAC 100VDC; DIGIKEY: 507-1903-ND; MANUFACTURER: Bel Fuse Inc; MPN: 0697H0500-01
J1 = connector:DM3AT-SF-PEJM5: CONN MICRO SD R/A PUSH-PUSH SMD; DESCRIPTION: CONN MICRO SD CARD PUSH-PUSH R/A; DIGIKEY: HR1964CT-ND; MANUFACTURER: Hirose Electric Co Ltd; MPN: DM3AT-SF-PEJM5
J2 = connector:TC2030-JLINK; DIGIKEY: DNP; MANUFACTURER: DNP; MPN: DNP
JP1 JP2 = SparkFun-Connectors:M02: Header 2 Standard 2-pin 0.1" header. Use with straight break away headers (SKU : PRT-00116), right angle break away headers (PRT-00553), swiss pins (PRT-00743), machine pins (PRT-00117), and female headers (PRT-00115). Molex polarized connector foot print use with SKU : PRT-08233 with associated crimp pins and housings.; DESCRIPTION: CONN HEADER PH TOP 2POS 2MM SMD; DIGIKEY: 455-1734-1-ND; MANUFACTURER: JST Sales America Inc.; MPN: B2B-PH-SM4-TB(LF)(SN)
L1 = passives:INDUCTOR: A very specific inductor; DESCRIPTION: FIXED IND 5.6NH 1.77A 40 MOHM; DIGIKEY: 490-11766-1-ND; MANUFACTURER: Murata; MPN: LQW15AN5N6B80D
L2 L3 = passives:FERRITE_BEAD; DESCRIPTION: FERRITE BEAD 1 KOHM 0402 1LN; DIGIKEY: 490-4003-1-ND; MANUFACTURER: Murata; MPN: BLM15HD102SN1D
Q1 = fets:MOSFET-NCHANNEL: Generic NMOS footprint; DESCRIPTION: MOSFET N-CH 60V 115MA SOT23-3; DIGIKEY: 2N7002-FDICT-ND; MANUFACTURER: Diodes Incorporated; MPN: 2N7002-7-F
Q2 = fets:NX3008PBK: MOSFET - P Channel; DIGIKEY: 568-10499-1-ND; MANUFACTURER: Nexperia; MOUSER: 771-NX3008PBK,215; MPN: NX3008PBK,215; NEWARK: 74T4665
R1 = resistor:R-US_: RESISTOR, American symbol; DESCRIPTION: RES SMD 1 OHM 5% 2W 2512; DIGIKEY: CRM2512-JW-1R0ELFCT-ND; MANUFACTURER: Bourns Inc.; MPN: CRM2512-JW-1R0ELF
R2 R3 = passives:RESISTOR: Resistor Basic schematic elements and footprints for 0201, 0402, 0603, 1206, and PTH resistors.; DESCRIPTION: RES SMD 10 OHM 1% 1/16W 0402; DIGIKEY: 311-10.0LRCT-ND; MANUFACTURER: Yageo; MPN: RC0402FR-0710RL
R4 = passives:RESISTOR: Resistor Basic schematic elements and footprints for 0201, 0402, 0603, 1206, and PTH resistors.; DESCRIPTION: RES 475 OHM 1% 1/16W 0402; DIGIKEY: RMCF0402FT475RCT-ND; MANUFACTURER: Stackpole Electronics Inc; MPN: RMCF0402FT475R
R5 = passives:RESISTOR: Resistor Basic schematic elements and footprints for 0201, 0402, 0603, 1206, and PTH resistors.; DESCRIPTION: RES SMD 750 OHM 1% 1/10W 0402; DIGIKEY: P750LCT-ND; MANUFACTURER: Panasonic Electronic Components; MPN: ERJ-2RKF7500X
R6 R7 = passives:RESISTOR: Resistor Basic schematic elements and footprints for 0201, 0402, 0603, 1206, and PTH resistors.; DESCRIPTION: RES SMD 1K OHM 0.1% 1/16W 0402; DIGIKEY: YAG2306CT-ND; MANUFACTURER: Yageo; MPN: RT0402BRE071KL
R8 R9 = passives:RESISTOR: Resistor Basic schematic elements and footprints for 0201, 0402, 0603, 1206, and PTH resistors.; DESCRIPTION: RES SMD 1.69K OHM 1% 1/16W 0402; DIGIKEY: YAG3044CT-ND; MANUFACTURER: Yageo; MPN: RC0402FR-071K69L
R10 R11 = passives:RESISTOR: Resistor Basic schematic elements and footprints for 0201, 0402, 0603, 1206, and PTH resistors.; DESCRIPTION: RES SMD 3.74KOHM 0.1% 1/16W 0402; DIGIKEY: P3.74KDCCT-ND; MANUFACTURER: Panasonic Electronic Components; MPN: ERA-2AEB3741X
R12 = passives:RESISTOR: Resistor Basic schematic elements and footprints for 0201, 0402, 0603, 1206, and PTH resistors.; DESCRIPTION: RES SMD 5.1K OHM 1% 1/10W 0402; DIGIKEY: P5.10KLCT-ND; MANUFACTURER: Panasonic Electronic Components; MPN: ERJ-2RKF5101X
R13-R23 = passives:RESISTOR: Resistor Basic schematic elements and footprints for 0201, 0402, 0603, 1206, and PTH resistors.; DESCRIPTION: RES SMD 10K OHM 1% 1/16W 0402; DIGIKEY: RMCF0402FT10K0CT-ND; MANUFACTURER: Stackpole Electronics Inc.; MPN: RMCF0402FT10K0
R24 = passives:RESISTOR: Resistor Basic schematic elements and footprints for 0201, 0402, 0603, 1206, and PTH resistors.; DESCRIPTION: RES SMD 34K OHM 1% 1/10W 0402; DIGIKEY: P34.0KLCT-ND; MANUFACTURER: Panasonic Electronic Components; MPN: ERJ-2RKF3402X
R25 = passives:RESISTOR: Resistor Basic schematic elements and footprints for 0201, 0402, 0603, 1206, and PTH resistors.; DESCRIPTION: RES SMD 66.5K OHM 1% 1/16W 0402; DIGIKEY: YAG3209CT-ND; MANUFACTURER: Yageo; MPN: RC0402FR-0766K5L
R26-R32 = passives:RESISTOR: Resistor Basic schematic elements and footprints for 0201, 0402, 0603, 1206, and PTH resistors.; DESCRIPTION: RES SMD 100K OHM 1% 1/16W 0402; DIGIKEY: 311-100KLRCT-ND; MANUFACTURER: Yageo; MPN: RC0402FR-07100KL
R33 = passives:RESISTOR: Resistor Basic schematic elements and footprints for 0201, 0402, 0603, 1206, and PTH resistors.; DESCRIPTION: RES SMD 825K OHM 1% 1/10W 0402; DIGIKEY: P825KLCT-ND; MANUFACTURER: Panasonic Electronic Components; MPN: ERJ-2RKF8253X
R34-R41 = passives:RESISTOR: Resistor Basic schematic elements and footprints for 0201, 0402, 0603, 1206, and PTH resistors.; DESCRIPTION: RES SMD 953K OHM 0.1% 1/8W 0805; DIGIKEY: P953KDACT-ND; MANUFACTURER: Panasonic Electronic Components; MPN: ERA-6AEB9533V
R42-R44 = passives:RESISTOR: Resistor Basic schematic elements and footprints for 0201, 0402, 0603, 1206, and PTH resistors.; DESCRIPTION: RES 1M OHM 1% 1/16W 0402; DIGIKEY: RMCF0402FT1M00CT-ND; MANUFACTURER: Stackpole Electronics Inc; MPN: RMCF0402FT1M00
S1 = switches:B3U: Switch; DIGIKEY: SW1020CT-ND; MANUFACTURER: Omron; MPN: B3U-1000P
TP3 TP4 = headers:TEST_POINT_0.078IN
U1 = chips:AB1815-T3: Ultra-low current RTC. 55nA quiescent @ 3V. 1.5-3.6V input.; DIGIKEY: 535-11936-1-ND; MANUFACTURER: Abracon; MPN: AB1815-T3
U2 = ada4096-4:ADA4096-4ACPZ-R7; DESCRIPTION: IC OPAMP GP 4 CIRCUIT 16LFCSP; DIGIKEY: ADA4096-4ACPZ-R7CT-ND; MANUFACTURER: Analog Devices Inc.; MANUFACTURER_PART_NUMBER: ADA40964ACPZR7; MPN: ADA4096-4ACPZ-R7; VENDOR: Analog Devices Inc
U3 = Particle:BGA725L6; DESCRIPTION: IC AMP MMIC RF LNA 20DB TSLP-6; DIGIKEY: BGA725L6E6327FTSA1CT-ND; MANUFACTURER: Infineon; MPN: BGA725L6E6327FTSA1
U4 = DS2401P+:DS2401P+: A one wire serial number chip.; DIGIKEY: DS2401P+-ND; MANUFACTURER: Maxim Integrated; MPN: DS2401P+; SPICEPREFIX: X
U5 = Particle:FILTERS; DESCRIPTION: FILTER SAW 1.575GHZ 5SMD; DIGIKEY: 587-5642-1-ND; MANUFACTURER: Taiyo Yuden; MPN: F6QA1G575H2JF-J
U6 = powerwatch:IRM-03-5V: A 5V 3W board mount power supply; DIGIKEY: 1866-3020-ND; MANUFACTURER: Mean Well USA; MPN: IRM-03-5
U7 = chips:LIS2DW12: ultra low power 3 axis accelerometer; DIGIKEY: 497-14851-1-ND; MANUFACTURER: STMicroelectronics; MOUSER: 511-LIS2DH12TR; MPN: LIS2DH12TR
U8 = u-blox:MAX-M8; DESCRIPTION: IC RECEIVER GPS/GNSS 18LCC; DIGIKEY: 672-1003-1-ND; MANUFACTURER: u-blox; MPN: MAX-M8Q-0
U9 = chips:MAX67XX: A simple watchdog timer with adjustable timeouts and reset time; DIGIKEY: MAX6749KA+TCT-ND; MANUFACTURER: Maxim Integrated; MPN: MAX6749KA+T
U10 = MAX7315ATET:MAX7315ATET; DESCRIPTION: IC I/O EXPANDER I2C 8B 16TQFN; DIGI-KEY_PART_NUMBER: MAX7315ATE+-ND; DIGI-KEY_PURCHASE_URL: https://www.digikey.com/product-detail/en/maxim-integrated/MAX7315ATE-/MAX7315ATE--ND/1513522?utm_source=snapeda&utm_medium=aggregator&utm_campaign=symbol; DIGIKEY: MAX7315ATE+-ND; MANUFACTURER: Maxim Integrated; MF: Maxim Integrated; MP: MAX7315ATE+; MPN: MAX7315ATE+; PACKAGE: TQFN-16 Maxim
U11 = ref2033:REF2033AIDDCR; DESCRIPTION: IC VREF SERIES 1.5V/3V 5SOT; DIGIKEY: 296-47351-1-ND; MANUFACTURER: Texas Instruments; MANUFACTURER_PART_NUMBER: REF2030AIDDCR; MPN: REF2030AIDDCR; VENDOR: Texas Instruments
U12-U14 = chips:SIP32510: Load switch, slew rate controlled. By Vishay; DIGIKEY: SIP32510DT-T1-GE3CT-ND; MANUFACTURER: Vishay; MPN: SIP32510DT-T1-GE3
U15 = chips:STM32L432KC: Simple STM32 Cortex M4. Features include a fast 32bit timer, 2 spi, 2 i2c, 2usart, hardware aes and more.; DIGIKEY: 497-16578-ND; MANUFACTURER: STMicroelectronics; MPN: STM32L432KCU6
U16 = tca9406:TCA9406DCUR; DESCRIPTION: IC TRNSLTR BIDIRECTIONAL US8; DIGIKEY: 296-28109-1-ND; MANUFACTURER: Texas Instruments; MANUFACTURER_PART_NUMBER: TCA9406DCUR; MPN: TCA9406DCUR; VENDOR: Texas Instruments
U17 = tps7933:TPS79330DBVR; DESCRIPTION: IC REG LINEAR 3V 200MA SOT23-5; DIGIKEY: 296-12159-1-ND; MANUFACTURER: Texas Instruments; MANUFACTURER_PART_NUMBER: TPS79330DBVR; MPN: TPS79330DBVR; VENDOR: Texas Instruments
V1 = varistor:S14K385: VARISTOR; DESCRIPTION: VARISTOR 620V 5KA DISC 14MM; DIGIKEY: 495-5945-ND; MANUFACTURER: EPCOS (TDK); MPN: B72214S2381K101
X1 = crystals:ABS05-32.768KHZ: 32.768kHz Crystal; DIGIKEY: 535-11899-1-ND; MANUFACTURER: Abracon; MPN: ABS05-32.768KHZ-T
X2 = crystals:ABS07-32.768KHZ: 32.768kHz Crystal; DIGIKEY: 535-9543-1-ND; MANUFACTURER: ABRACON; MPN: ABS07-32.768KHZ-7-T